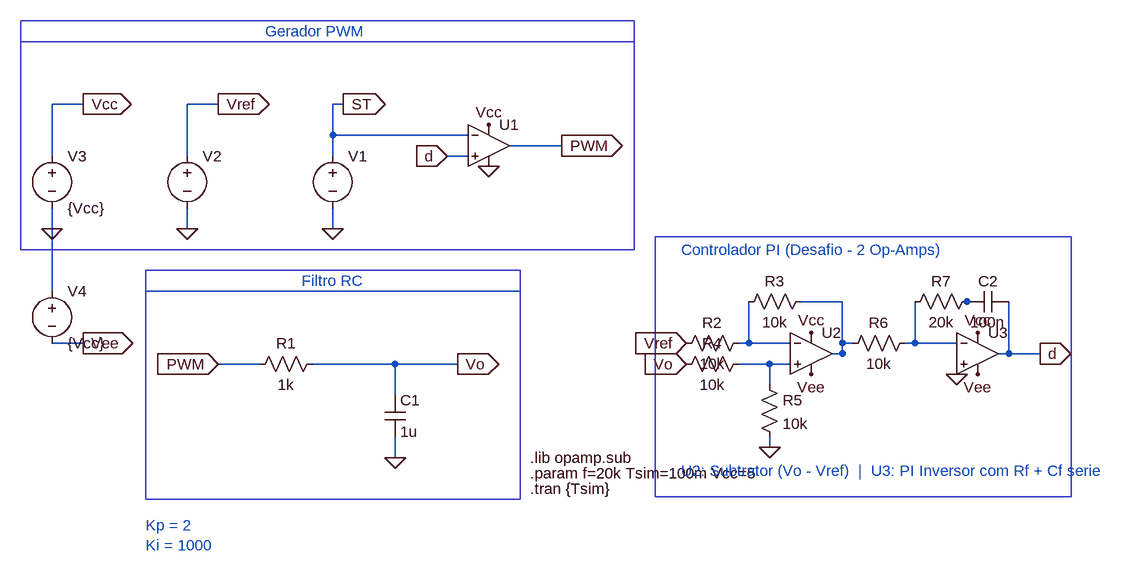
[diagram p0: schematic PI_alunos.asc]
PI_alunos.asc, the LTspice schematic file:
Version 4.1
SHEET 1 2332 1412
WIRE -320 16 -368 16
WIRE -112 16 -160 16
WIRE 80 16 64 16
WIRE 64 64 64 16
WIRE 272 64 64 64
WIRE 416 80 336 80
WIRE -368 96 -368 16
WIRE -160 96 -160 16
WIRE 64 96 64 64
WIRE 272 96 240 96
WIRE -368 208 -368 176
WIRE -160 208 -160 176
WIRE 64 208 64 176
WIRE 352 304 -224 304
WIRE -48 416 -112 416
WIRE 160 416 32 416
WIRE 256 416 160 416
WIRE 160 464 160 416
WIRE 160 560 160 528
WIRE -368 304 -368 208
WIRE -320 384 -368 384
FLAG 64 208 0
FLAG 80 16 ST
IOPIN 80 16 Out
FLAG 304 112 0
FLAG 240 96 d
IOPIN 240 96 In
FLAG 416 80 PWM
IOPIN 416 80 Out
FLAG -160 208 0
FLAG -112 16 Vref
IOPIN -112 16 Out
FLAG 160 560 0
FLAG -112 416 PWM
IOPIN -112 416 In
FLAG 256 416 Vo
IOPIN 256 416 Out
FLAG -368 208 0
FLAG -320 16 Vcc
IOPIN -320 16 Out
FLAG 304 48 Vcc
FLAG -320 384 Vee
IOPIN -320 384 Out
FLAG 800 368 Vcc
FLAG 800 432 Vee
FLAG 736 544 0
FLAG 608 416 Vo
IOPIN 608 416 In
FLAG 608 384 Vref
IOPIN 608 384 In
FLAG 1056 368 Vcc
FLAG 1056 432 Vee
FLAG 1024 432 0
FLAG 1152 400 d
IOPIN 1152 400 Out
WIRE 768 416 688 416
WIRE 736 416 736 448
WIRE 736 544 736 528
WIRE 768 384 688 384
WIRE 704 384 704 320
WIRE 848 320 784 320
WIRE 848 400 848 320
WIRE 848 400 832 400
WIRE 848 384 848 400
WIRE 864 384 848 384
WIRE 1024 384 944 384
WIRE 960 384 960 320
WIRE 1024 432 1024 416
WIRE 1040 320 1040 320
WIRE 1104 400 1104 320
WIRE 1104 400 1088 400
WIRE 1152 400 1104 400
SYMBOL voltage 64 80 R0
WINDOW 3 24 96 Invisible 2
WINDOW 123 0 0 Left 0
WINDOW 39 0 0 Left 0
SYMATTR Value PULSE(0 5 0 {0.999/f} {0.001/f} 0 {1/f})
SYMATTR InstName V1
SYMBOL Opamps\\UniversalOpamp2 304 80 R0
SYMATTR InstName U1
SYMBOL voltage -160 80 R0
WINDOW 3 24 96 Invisible 2
WINDOW 123 0 0 Left 0
WINDOW 39 0 0 Left 0
SYMATTR Value PWL(0 {Vcc/4} {Tsim/4} {Vcc/4} {1.0001*Tsim/4} {Vcc/2} {Tsim/2} {Vcc/2} {1.0001*Tsim/2} 0 {3*Tsim/4} 0 {3.0001*Tsim/4} {3*Vcc/4})
SYMATTR InstName V2
SYMBOL cap 144 464 R0
SYMATTR InstName C1
SYMATTR Value 1u
SYMBOL res 48 400 R90
WINDOW 0 0 56 VBottom 2
WINDOW 3 32 56 VTop 2
SYMATTR InstName R1
SYMATTR Value 1k
SYMBOL voltage -368 80 R0
WINDOW 123 0 0 Left 0
WINDOW 39 0 0 Left 0
SYMATTR InstName V3
SYMATTR Value {Vcc}
SYMBOL voltage -368 288 R0
WINDOW 123 0 0 Left 0
WINDOW 39 0 0 Left 0
SYMATTR InstName V4
SYMATTR Value {Vcc}
SYMBOL Opamps\\UniversalOpamp2 800 400 R0
SYMATTR InstName U2
SYMBOL Opamps\\UniversalOpamp2 1056 400 R0
SYMATTR InstName U3
SYMBOL res 704 400 R90
WINDOW 0 0 56 VBottom 2
WINDOW 3 32 56 VTop 2
SYMATTR InstName R4
SYMATTR Value 10k
SYMBOL res 720 432 R0
SYMATTR InstName R5
SYMATTR Value 10k
SYMBOL res 704 368 R90
WINDOW 0 0 56 VBottom 2
WINDOW 3 32 56 VTop 2
SYMATTR InstName R2
SYMATTR Value 10k
SYMBOL res 800 304 R90
WINDOW 0 0 56 VBottom 2
WINDOW 3 32 56 VTop 2
SYMATTR InstName R3
SYMATTR Value 10k
SYMBOL res 960 368 R90
WINDOW 0 0 56 VBottom 2
WINDOW 3 32 56 VTop 2
SYMATTR InstName R6
SYMATTR Value 10k
SYMBOL res 1056 304 R90
WINDOW 0 0 56 VBottom 2
WINDOW 3 32 56 VTop 2
SYMATTR InstName R7
SYMATTR Value 20k
SYMBOL cap 1104 304 R90
WINDOW 0 0 32 VBottom 2
WINDOW 3 32 32 VTop 2
SYMATTR InstName C2
SYMATTR Value 100n
TEXT 368 608 Left 2 !.tran {Tsim}
TEXT 368 584 Left 2 !.param f=20k Tsim=100m Vcc=5
TEXT -40 -96 Left 2 ;Gerador PWM
TEXT 16 288 Left 2 ;Filtro RC
TEXT -224 664 Left 2 ;Kp = 2\nKi = 1000
TEXT 368 560 Left 2 !.lib opamp.sub
LINE Normal -416 -80 528 -80
RECTANGLE Normal 352 624 -224 272
RECTANGLE Normal -416 240 528 -112
TEXT 600 240 Left 2 ;Controlador PI (Desafio - 2 Op-Amps)
TEXT 600 580 Left 2 ;U2: Subtrator (Vo - Vref)  |  U3: PI Inversor com Rf + Cf serie
RECTANGLE Normal 1200 620 560 220

The netlist it stands for:
* PI_alunos.asc
V1 ST 0 PULSE(0 5 0 {0.999/f} {0.001/f} 0 {1/f})
X§U1 d ST Vcc 0 PWM level.2 Avol=1Meg GBW=10Meg Slew=10Meg ilimit=25m rail=0 Vos=0 phimargin=45 en=0 enk=0 in=0 ink=0 Rin=500Meg  ; pins IN+ IN- V+ V- OUT
V2 Vref 0 PWL(0 {Vcc/4} {Tsim/4} {Vcc/4} {1.0001*Tsim/4} {Vcc/2} {Tsim/2} {Vcc/2} {1.0001*Tsim/2} 0 {3*Tsim/4} 0 {3.0001*Tsim/4} {3*Vcc/4})
C1 Vo 0 1u
R1 Vo PWM 1k
V3 Vcc 0 {Vcc}
V4 0 Vee {Vcc}
X§U2 N002 N003 Vcc Vee N004 level.2 Avol=1Meg GBW=10Meg Slew=10Meg ilimit=25m rail=0 Vos=0 phimargin=45 en=0 enk=0 in=0 ink=0 Rin=500Meg  ; pins IN+ IN- V+ V- OUT
X§U3 0 N005 Vcc Vee d level.2 Avol=1Meg GBW=10Meg Slew=10Meg ilimit=25m rail=0 Vos=0 phimargin=45 en=0 enk=0 in=0 ink=0 Rin=500Meg  ; pins IN+ IN- V+ V- OUT
R4 N002 Vo 10k
R5 N002 0 10k
R2 N003 Vref 10k
R3 N004 N003 10k
R6 N005 N004 10k
R7 N006 N005 20k
C2 d N006 100n
.tran {Tsim}
.param f=20k Tsim=100m Vcc=5
* Gerador PWM
* Filtro RC
* Kp = 2
* Ki = 1000
.lib opamp.sub
* Controlador PI (Desafio - 2 Op-Amps)
* U2: Subtrator (Vo - Vref)  |  U3: PI Inversor com Rf + Cf serie
.lib UniversalOpamps2.sub
.backanno
.end